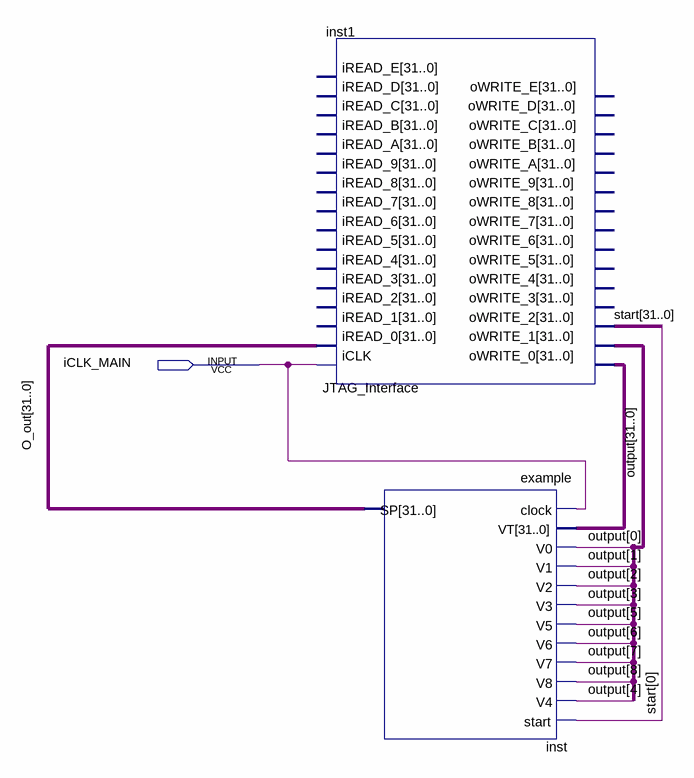
[diagram p0: schematic sheet]
// Quartus schematic MyDesign.bdf as structural Verilog: 2 symbols, 1 pins
module MyDesign (
  input  iCLK_MAIN
);

  wire [31:0] inst1_owrite_0, O_out, \output , start;

  JTAG_Interface inst1 (
    .iCLK(iCLK_MAIN), .iREAD_0(O_out), .oWRITE_0(inst1_owrite_0), .oWRITE_1(\output ), .oWRITE_2(start));  // open: iREAD_1, iREAD_2, iREAD_3, iREAD_4, iREAD_5, iREAD_6, iREAD_7, iREAD_8, iREAD_9, iREAD_A, iREAD_B, iREAD_C, iREAD_D, iREAD_E, oWRITE_3, oWRITE_4, oWRITE_5, oWRITE_6, oWRITE_7, oWRITE_8, oWRITE_9, oWRITE_A, oWRITE_B, oWRITE_C, oWRITE_D, oWRITE_E
  example inst (
    .clock(iCLK_MAIN), .VT(inst1_owrite_0), .V0(\output [0]), .V1(\output [1]), .V2(\output [2]),
    .V3(\output [3]), .V5(\output [5]), .V6(\output [6]), .V7(\output [7]), .V8(\output [8]),
    .V4(\output [4]), .start(start[0]), .SP(O_out));
endmodule
